# Altium schematic sheet STM32_microcontroller_IOs.SchDoc: STM32_microcontroller_IOs
size A4; CompanyName: STMicroelectronics; Organization: Microcontrollers Division; SheetNumber: 3; SheetTotal: 8
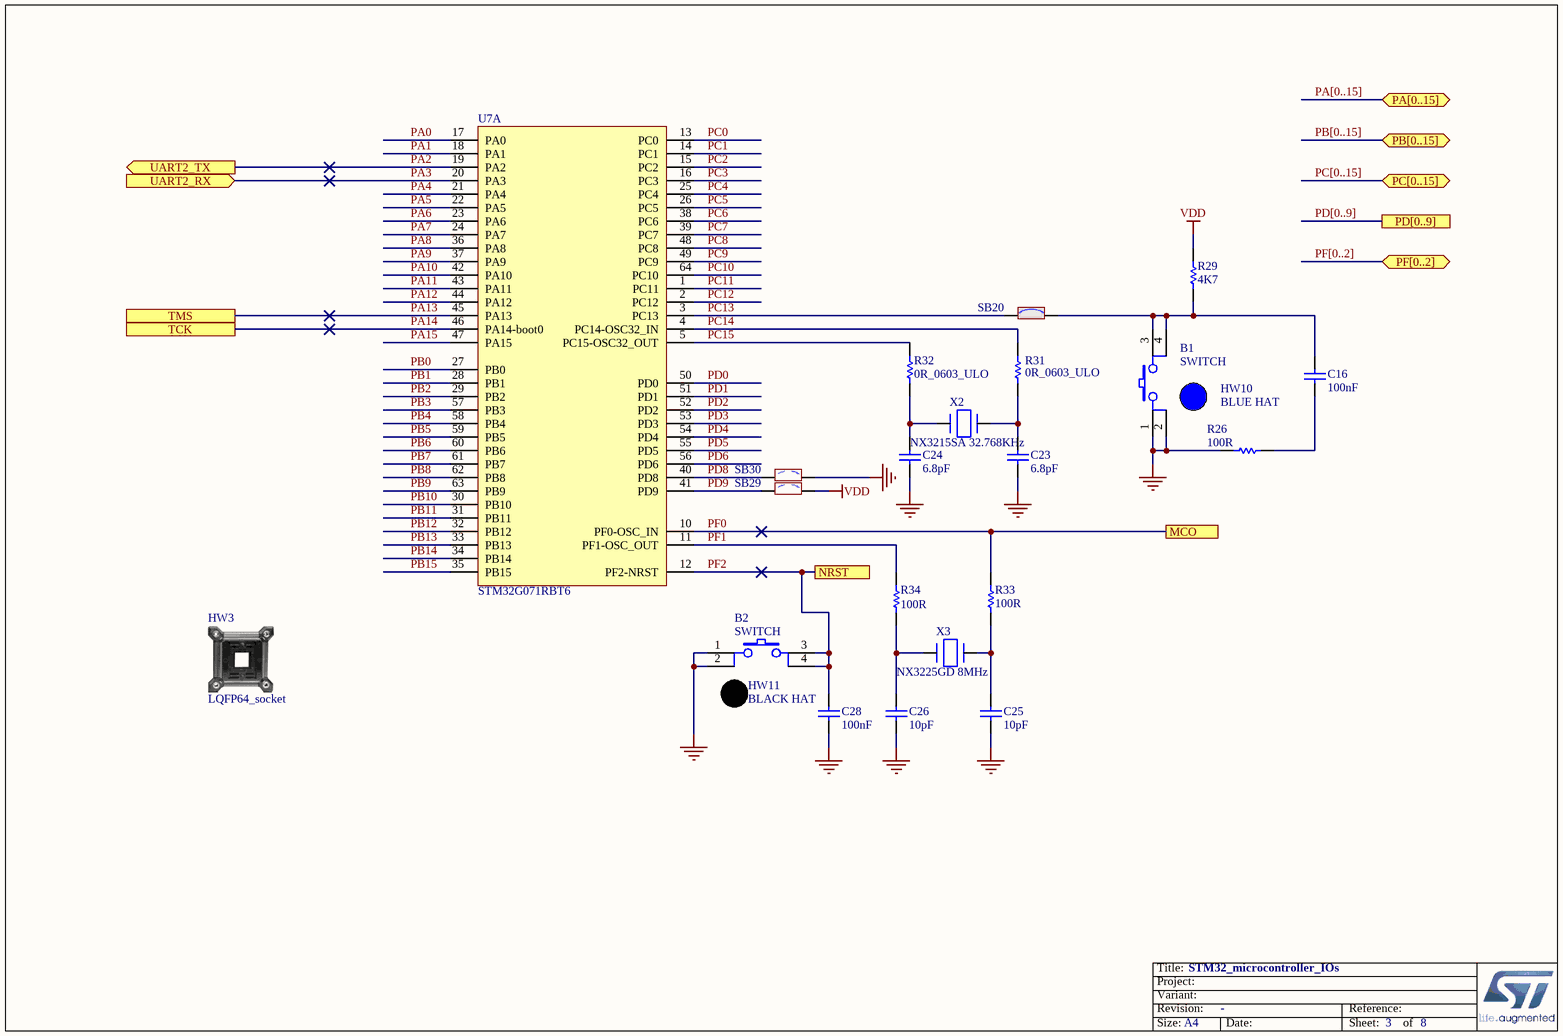
[diagram p0: STM32_microcontroller_IOs.SchDoc]

## Parts
B1  value SWITCH  [SWI_WEALTHMETAL_TD-0341_4P_BLUE]  (hidden comment: SW-PUSH-CMS)
B2  value SWITCH  [SWI_WEALTHMETAL_TD-0341_4P_BLACK]  (hidden comment: SW-PUSH-CMS)
C16  value 100nF  [C0603]  (hidden comment: Capacitor)
C23  value 6.8pF  [C0603]  (hidden comment: Capacitor)
C24  value 6.8pF  [C0603]  (hidden comment: Capacitor)
C25  value 10pF  [C0603]  (hidden comment: Capacitor)
C26  value 10pF  [C0603]  (hidden comment: Capacitor)
C28  value 100nF  [C0603]  (hidden comment: Capacitor)
HW3  value LQFP64_socket  (hidden comment: SOCKET_LQFP64)  (mechanical)
HW10  value BLUE HAT  (hidden comment: BUTTON_HAT_BLUE)  (mechanical)
HW11  value BLACK HAT  (hidden comment: BUTTON_HAT_BLACK)  (mechanical)
R26  value 100R  [R0603]  (hidden comment: Resistor)
R29  value 4K7  [R0603]  (hidden comment: Resistor)
R31  value 0R_0603_ULO  [R0603]  (hidden comment: Resistor)
R32  value 0R_0603_ULO  [R0603]  (hidden comment: Resistor)
R33  value 100R  [R0603]  (hidden comment: Resistor)
R34  value 100R  [R0603]  (hidden comment: Resistor)
SB20  SB_ON  [SOLDER-BRIDGE_R0603-0R]  (value not drawn)
SB29  SB_OFF  [SOLDER-BRIDGE_R0603-0R]  (value not drawn)
SB30  SB_OFF  [SOLDER-BRIDGE_R0603-0R]  (value not drawn)
U7  STM32G071RBT6  [ICC_LQFP64_10X10_P050_SOCKET_YAMAICHI_IC149-064-069-B5]  (part A of 2)
X2  value NX3215SA 32.768KHz  [CRY_NX3215SA_2P]  (hidden comment: XTAL_2_PINS)
X3  value NX3225GD 8MHz  [CRY_NX3225GD_2P]  (hidden comment: XTAL_2_PINS)

## Ports
MCO, NRST, PA[0..15] (bidir), PB[0..15] (bidir), PC[0..15] (bidir), PD[0..9], PF[0..2] (bidir), TCK, TMS, UART2_RX (in), UART2_TX (out)

## Nets
GND: B1.1 B1.2 B2.1 B2.2 C23.1 C24.1 C25.1 C26.1 C28.1 R26.1 SB30.2
VDD: R29.2 SB29.2
PA0: U7.17(PA0)
PA1: U7.18(PA1)
PA2: U7.19(PA2) ; port UART2_TX
PA3: U7.20(PA3) ; port UART2_RX
PA4: U7.21(PA4)
PA5: U7.22(PA5)
PA6: U7.23(PA6)
PA7: U7.24(PA7)
PA8: U7.36(PA8)
PA9: U7.37(PA9)
PA10: U7.42(PA10)
PA11: U7.43(PA11)
PA12: U7.44(PA12)
PA13: U7.45(PA13) ; port TMS
PA14: U7.46(PA14-boot0) ; port TCK
PA15: U7.47(PA15)
PB0: U7.27(PB0)
PB1: U7.28(PB1)
PB2: U7.29(PB2)
PB3: U7.57(PB3)
PB4: U7.58(PB4)
PB5: U7.59(PB5)
PB6: U7.60(PB6)
PB7: U7.61(PB7)
PB8: U7.62(PB8)
PB9: U7.63(PB9)
PB10: U7.30(PB10)
PB11: U7.31(PB11)
PB12: U7.32(PB12)
PB13: U7.33(PB13)
PB14: U7.34(PB14)
PB15: U7.35(PB15)
PC0: U7.13(PC0)
PC1: U7.14(PC1)
PC2: U7.15(PC2)
PC3: U7.16(PC3)
PC4: U7.25(PC4)
PC5: U7.26(PC5)
PC6: U7.38(PC6)
PC7: U7.39(PC7)
PC8: U7.48(PC8)
PC9: U7.49(PC9)
PC10: U7.64(PC10)
PC11: U7.1(PC11)
PC12: U7.2(PC12)
PC13: SB20.1 U7.3(PC13)
PC14: R31.1 U7.4(PC14-OSC32_IN)
PC15: R32.1 U7.5(PC15-OSC32_OUT)
PD0: U7.50(PD0)
PD1: U7.51(PD1)
PD2: U7.52(PD2)
PD3: U7.53(PD3)
PD4: U7.54(PD4)
PD5: U7.55(PD5)
PD6: U7.56(PD6)
PD8: SB30.1 U7.40(PD8)
PD9: SB29.1 U7.41(PD9)
PF0: R33.1 U7.10(PF0-OSC_IN) ; port MCO
PF1: R34.1 U7.11(PF1-OSC_OUT)
PF2: B2.3 B2.4 C28.2 U7.12(PF2-NRST) ; port NRST
NetB1_3: B1.3 B1.4 C16.2 R29.1 SB20.2
NetC16_1: C16.1 R26.2
NetC23_2: C23.2 R31.2 X2.2(X2)
NetC24_2: C24.2 R32.2 X2.1(X1)
NetC25_2: C25.2 R33.2 X3.2(X2)
NetC26_2: C26.2 R34.2 X3.1(X1)

## Buses and harness runs
bus PA[0..15] = port PA[0..15]
bus PB[0..15] = port PB[0..15]
bus PC[0..15] = port PC[0..15]
bus PD[0..9] = port PD[0..9]
bus PF[0..2] = port PF[0..2]

## Notes on the sheet
- Title:
- Project:
- Size:
- Revision:
- Variant:
- A4
- -
- Date:
- Reference:
- Sheet:
- of

## Library data of the parts
B1 = MCD-00002: Non-Open Push-Button 0.1A 24V; Part_Type: Misc; Manufacturer_Part_Number: TD-0341; Manufacturer: WEALTHMETAL; Provided_By: SUBCO; Internal_Part_Number: MCD-00002; Status: Released; ComponentLink1Description: Datasheet; ComponentLink1URL: http://tunmcdsvn.tun.st.com/Component_Datasheet_Library/Trunk/Misc/Wealthmetal_Tact-Switch_TD0341; ECCN_US: n/a; ECCN_EU: n/a
B2 = MCD-00001: Non-Open Push-Button 0.1A 24V BLACK; Part_Type: Misc; Manufacturer_Part_Number: TD-0341; Manufacturer: WEALTHMETAL; Provided_By: SUBCO; Internal_Part_Number: MCD-00001; Status: Released; ComponentLink1Description: Datasheet; ComponentLink1URL: http://tunmcdsvn.tun.st.com/Component_Datasheet_Library/Trunk/Misc/Wealthmetal_Tact-Switch_TD0341; ECCN_US: n/a; ECCN_EU: n/a
C16 C28 = MCD-00211: Capacitor, MLCC, 100nF, 16V, X7R, 10%, 0603, T=0,8mm; Manufacturer_Part_Number: CC0603KRX7R7BB104; Manufacturer: YAGEO; ECCN_US: EAR99; ECCN_EU: NEC; Provided_By: SUBCO; Internal_Part_Number: MCD-00211; Status: Released; Part_Type: Capacitor; Package: C0603; ComponentLink1Description: Datasheet; ComponentLink1URL: http://tunmcdsvn.tun.st.com/Component_Datasheet_Library/Trunk/Capacitors/Yageo_Multilayer_Capacitor_X7R_series_100pF_to_22uF
C23 C24 = MCD-00650: Capacitor, MLCC, 6.8pF, 50V, NPO, -/+0.25pF, 0603, T=0,8mm; Part_Preference: Recommended; Manufacturer: YAGEO; Manufacturer_Part_Number: CC0603CRNPO9BN6R8; Internal_Part_Number: MCD-00650; Status: Checked; Part_Type: Capacitor; Package: C0603; ComponentLink1Description: Datasheet; ComponentLink1URL: http://tunmcdsvn.tun.st.com/Component_Datasheet_Library/Trunk/Capacitors/Yageo_Capacitor_NP0_16V-to-50V; Order_Code_Digikey: 311-3861-1-ND; Order_Code_Farnell: N/A; Order_Code_RS: N/A
C25 C26 = MCD-00637: Capacitor, MLCC, 10pF, 50V, NPO, 5%, 0603, T=0,8mm; Manufacturer_Part_Number: CC0603JRNPO9BN100; Manufacturer: YAGEO; ECCN_US: EAR99; ECCN_EU: NEC; Provided_By: SUBCO; Internal_Part_Number: MCD-00637; Status: Released; Part_Type: Capacitor; Package: C0603; ComponentLink1Description: Datasheet; ComponentLink1URL: http://tunmcdsvn.tun.st.com/Component_Datasheet_Library/Trunk/Capacitors/Yageo_Capacitor_NP0_16V-to-50V
HW3 = MCD-01253: Yamaichi socket for LQFP64, with positioning pins.; Part_Type: Misc; Manufacturer_Part_Number: IC149-064-169-B5; Provided_By: SUBCO; Internal_Part_Number: MCD-01253; Status: Released; Manufacturer: YAMAICHI; ComponentLink1Description: Datasheet; ComponentLink1URL: http://tunmcdsvn.tun.st.com/Component_Datasheet_Library/Trunk/Misc/Yamaichi_LQFP_socket_IC149_64p_10x10_12789; ECCN_US: n/a; ECCN_EU: n/a
HW10 = MCD-00634: Blue Hat for switch TD0341X-G01-BLU; Part_Type: Mechanical; Manufacturer_Part_Number: 988.16.09.3.00002_SH-517; Manufacturer: JIUBABA; Provided_By: SUBCO; Internal_Part_Number: MCD-00634; Status: Released; ECCN_US: n/a; ECCN_EU: n/a; ComponentLink1Description: Datasheet; ComponentLink1URL: http://tunmcdsvn.tun.st.com/Component_Datasheet_Library/Trunk/Mechanical/Jiubaba_HAT_SH-517
HW11 = MCD-00635: Black Hat for switch TD0341X-G01-BLA; Part_Type: Mechanical; Manufacturer_Part_Number: 988.16.09.3.00003_SH-517; Manufacturer: JIUBABA; Provided_By: SUBCO; Internal_Part_Number: MCD-00635; Status: Released; ECCN_US: n/a; ECCN_EU: n/a; ComponentLink1Description: Datasheet; ComponentLink1URL: http://tunmcdsvn.tun.st.com/Component_Datasheet_Library/Trunk/Mechanical/Jiubaba_HAT_SH-517
R26 R33 R34 = MCD-00224: Resistor,100R,0603,1%,1/10W; Manufacturer_Part_Number: RC0603FR-07100RL; Manufacturer: YAGEO; ECCN_US: EAR99; ECCN_EU: NEC; Provided_By: SUBCO; Internal_Part_Number: MCD-00224; Status: Released; Part_Type: Resistor; Package: R0603; ComponentLink1Description: Datasheet; ComponentLink1URL: http://tunmcdsvn.tun.st.com/Component_Datasheet_Library/Trunk/Resistors/Yageo_Resistor_RC0603-series
R29 = MCD-00219: Resistor,4K7,0603,1%,1/10W; Manufacturer_Part_Number: RC0603FR-074K7L; Manufacturer: YAGEO; ECCN_US: EAR99; ECCN_EU: NEC; Provided_By: SUBCO; Internal_Part_Number: MCD-00219; Status: Released; Part_Type: Resistor; Package: R0603; ComponentLink1Description: Datasheet; ComponentLink1URL: http://tunmcdsvn.tun.st.com/Component_Datasheet_Library/Trunk/Resistors/Yageo_Resistor_RC0603-series
R31 R32 = MCD-00181: Resistor,0R,0603,ULO; Manufacturer_Part_Number: PMR03EZPJ000; Manufacturer: ROHM; ECCN_US: EAR99; ECCN_EU: NEC; Provided_By: SUBCO; Internal_Part_Number: MCD-00181; Status: Released; Part_Type: Resistor; Package: R0603; ComponentLink1Description: Datasheet; ComponentLink1URL: http://tunmcdsvn.tun.st.com/Component_Datasheet_Library/Trunk/Resistors/ROHM_ULtra_low_Ohmic_Resistor_PMR10EZPJ000
SB20 = MCD-00071: Solder Bridge ON; Part_Type: Mechanical; Manufacturer_Part_Number: RC0603JR-070RL; Manufacturer: YAGEO; Provided_By: SUBCO; Internal_Part_Number: MCD-00071; ECCN_US: n/a; ECCN_EU: n/a; Status: Released; Package: SB0603; ComponentLink1Description: Datasheet; ComponentLink1URL: http://tunmcdsvn.tun.st.com/Component_Datasheet_Library/Trunk/Resistors/Yageo_Resistor_RC0603-series
SB29 SB30 = MCD-00072: Solder Bridge OFF; Part_Type: Mechanical; Manufacturer_Part_Number: RC0603JR-070RL; Manufacturer: YAGEO; Provided_By: SUBCO; Internal_Part_Number: MCD-00072; Status: Released; ECCN_US: n/a; ECCN_EU: n/a; Package: SB0603; ComponentLink1Description: Datasheet; ComponentLink1URL: http://tunmcdsvn.tun.st.com/Component_Datasheet_Library/Trunk/Resistors/Yageo_Resistor_RC0603-series
U7 = MCD-00662: Medium-density performance line ARM-based 32-bit MCU with 128KB Flash. LQFP64 IC149-064-069-B5 socket footprint.; Part_Type: IC; Manufacturer: STMICROELECTRONICS; BMS_Part_Number: 9175318; ECCN_US: 3A991A2; ECCN_EU: NEC; Provided_By: SUBCO with ST control; Internal_Part_Number: MCD-00662; Value: STM32G071RBT6; Status: Checked; Manufacturer_Part_Number: STM32G071RBT6; Package: LQFP64 IC149-064-069-B5 socket; ComponentLink1Description: Datasheet; ComponentLink1URL: http://tunmcdsvn.tun.st.com/Component_Datasheet_Library/Trunk/IC/STM_POA_ LQFP 10x10 64L
X2 = MCD-00091: Crystal 32.768kHz, 6pF, +-20ppm, 50Kohms max, SMD; Part_Type: Crystal_Osc; Manufacturer_Part_Number: NX3215SA 32.768KHz EXS00A-MU00525; Manufacturer: NDK; BMS_Part_Number: 9157034; ECCN_US: EAR99; ECCN_EU: NEC; Provided_By: SUBCO; Internal_Part_Number: MCD-00091; Status: Released; ComponentLink1Description: Datasheet; ComponentLink1URL: http://tunmcdsvn.tun.st.com/Component_Datasheet_Library/Trunk/Crystal_Osc/NDK_Crystal-For-ST_NX3215SA 32.768KHz EXS00A-MU00525 (EXS10B-21238); Order_Code_Digikey: 644-1386
X3 = MCD-00092: Crystal 8MHz, 8pF, +-20ppm, 500ohms max,  SMD; Part_Type: Crystal_Osc; Manufacturer_Part_Number: NX3225GD 8MHz EXS00A-CG04874; Manufacturer: NDK; BMS_Part_Number: 9157029; ECCN_US: EAR99; ECCN_EU: NEC; Provided_By: SUBCO; Internal_Part_Number: MCD-00092; Status: Released; ComponentLink1Description: Datasheet; ComponentLink1URL: http://tunmcdsvn.tun.st.com/Component_Datasheet_Library/Trunk/Crystal_Osc/NDK_Crystal-For-ST_NX3225GD 8MHz EXS00A-CG04874 (EXS10B-20725); Order_Code_Digikey: 644-1391